# Altium schematic sheet SBH_Charger_USB_PD.SchDoc: Sample Sheet Title
size B; Date: MM/DD/YYYY; Author: Sample Author; Organization: ORGANIZATION; Address1: ADDRESS 1; Address2: ADDRESS 2; Address3: ADDRESS 3; Address4: ADDRESS 4; Revision: -; SheetNumber: 3; SheetTotal: 5; ENG_APP_DATE: --/--/--; DSN_APP_DATE: --/--/--; CHK_APP_DATE: --/--/--
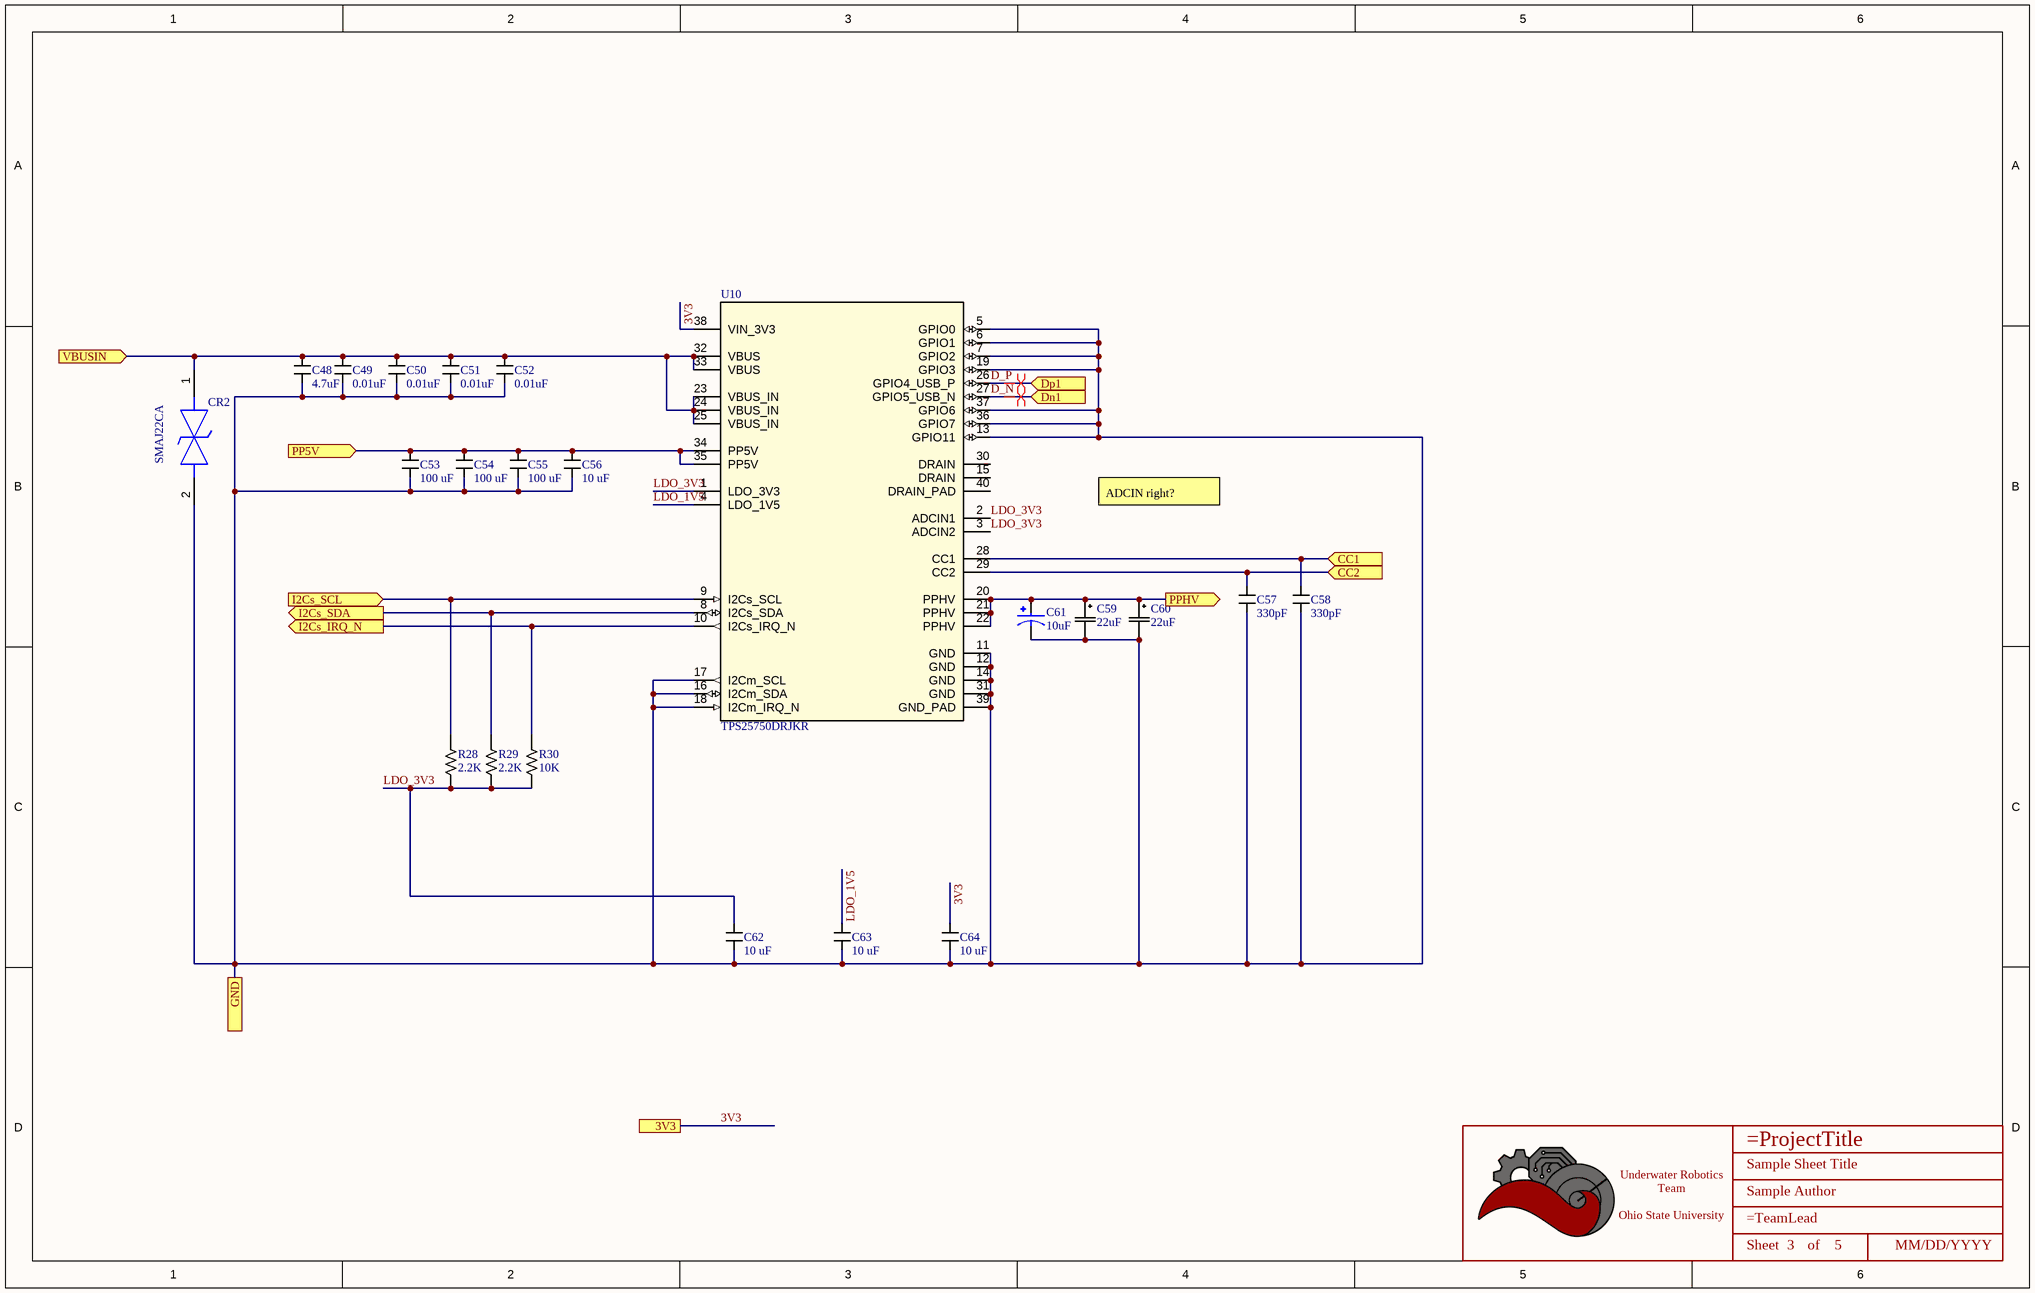
[diagram p0: SBH_Charger_USB_PD.SchDoc]

## Parts
*  Title_Block  [LOGO]  (value not drawn)  (graphical)
C48  value 4.7uF  [CAPACITOR_0603]  (hidden comment: 4.7uF Ceramic 6.3V)
C49  value 0.01uF  [CAPACITOR_0603]  (hidden comment: 10nF Ceramic 6.3V)
C50  value 0.01uF  [CAPACITOR_0603]  (hidden comment: 10nF Ceramic 6.3V)
C51  value 0.01uF  [CAPACITOR_0603]  (hidden comment: 10nF Ceramic 6.3V)
C52  value 0.01uF  [CAPACITOR_0603]  (hidden comment: 10nF Ceramic 6.3V)
C53  Value (uF): 100 uF  [CAPACITOR_0603]  (hidden comment: 100uF Ceramic 6.3V)
C54  Value (uF): 100 uF  [CAPACITOR_0603]  (hidden comment: 100uF Ceramic 6.3V)
C55  Value (uF): 100 uF  [CAPACITOR_0603]  (hidden comment: 100uF Ceramic 6.3V)
C56  Value (uF): 10 uF  [CAPACITOR_0603]  (hidden comment: 10uF Ceramic 6.3V)
C57  value 330pF  [CAPACITOR_0603]  (hidden comment: 330pF Ceramic 16V)
C58  value 330pF  [CAPACITOR_0603]  (hidden comment: 330pF Ceramic 16V)
C59  value 22uF  [PCAP_8x5.4-ELECT_NCA]  (hidden comment: 22uF electrolytic 35 V)
C60  value 22uF  [PCAP_8x5.4-ELECT_NCA]  (hidden comment: 22uF electrolytic 35 V)
C61  value 10uF  [CAP_EEHZC1J100P]  (hidden comment: 10uF electrolytic 63V)
C62  Value (uF): 10 uF  [CAPACITOR_0603]  (hidden comment: 10uF Ceramic 6.3V)
C63  Value (uF): 10 uF  [CAPACITOR_0603]  (hidden comment: 10uF Ceramic 6.3V)
C64  Value (uF): 10 uF  [CAPACITOR_0603]  (hidden comment: 10uF Ceramic 6.3V)
CR2  SMAJ22CA  [FP-SMAJ-CA-MFG]
R28  Value  (Ohms): 2.2K  [RESISTOR_0402]  (hidden comment: 2.2k Ohm 1% 1/16W)
R29  Value  (Ohms): 2.2K  [RESISTOR_0402]  (hidden comment: 2.2k Ohm 1% 1/16W)
R30  Value  (Ohms): 10K  [RESISTOR_0402]  (hidden comment: 10k Ohm 1% 1/16W)
U10  TPS25750DRJKR  [38-WQFN (4x6)]

## Ports
3V3, CC1 (in), CC2 (in), Dn1 (in), Dp1 (in), GND, I2Cs_IRQ_N (out), I2Cs_SCL (in), I2Cs_SDA (out), PP5V (in), PPHV (out), VBUSIN (in)

## Nets
3V3: C64.1 U10.38(VIN_3V3) ; port 3V3
CC1: C58.1 U10.28(CC1) ; port CC1
CC2: C57.1 U10.29(CC2) ; port CC2
D_N: U10.27(GPIO5_USB_N) ; port Dn1
D_P: U10.26(GPIO4_USB_P) ; port Dp1
GND: C48.2 C49.2 C50.2 C51.2 C52.2 C53.2 C54.2 C55.2 C56.2 C57.2 C58.2 C59.2 C60.2 C61.2 C62.2 C63.2 C64.2 CR2.2 U10.5(GPIO0) U10.6(GPIO1) U10.7(GPIO2) U10.11(GND) U10.12(GND) U10.13(GPIO11) U10.14(GND) U10.16(I2Cm_SDA) U10.17(I2Cm_SCL) U10.18(I2Cm_IRQ_N) U10.19(GPIO3) U10.31(GND) U10.36(GPIO7) U10.37(GPIO6) U10.39(GND_PAD) ; port GND
I2Cs_IRQ_N: R30.1 U10.10(I2Cs_IRQ_N) ; port I2Cs_IRQ_N
I2Cs_SCL: R28.1 U10.9(I2Cs_SCL) ; port I2Cs_SCL
I2Cs_SDA: R29.1 U10.8(I2Cs_SDA) ; port I2Cs_SDA
LDO_1V5: C63.1 U10.4(LDO_1V5)
LDO_3V3: C62.1 R28.2 R29.2 R30.2 U10.1(LDO_3V3) U10.2(ADCIN1) U10.3(ADCIN2)
PP5V: C53.1 C54.1 C55.1 C56.1 U10.34(PP5V) U10.35(PP5V) ; port PP5V
PPHV: C59.1 C60.1 C61.1 U10.20(PPHV) U10.21(PPHV) U10.22(PPHV) ; port PPHV
VBUSIN: C48.1 C49.1 C50.1 C51.1 C52.1 CR2.1 U10.23(VBUS_IN) U10.24(VBUS_IN) U10.25(VBUS_IN) U10.32(VBUS) U10.33(VBUS) ; port VBUSIN

Not connected (* = marked no-connect by the designer): U10 15(DRAIN) 30(DRAIN) 40(DRAIN_PAD)

## Layout directives
differential pair: D_N, D_P

## Notes on the sheet
- ADCIN right?
- DWG. NO.
- REV.
- SHT.
- THIS DOCUMENT AND THE DATA DISCLOSED HEREIN OR HEREWITH IS THE PROPERTY OF ALTIUM LIMITED AND MAY BE FREELY DISTRIBUTED IN WHOLE. NO RIGHTS ARE RESERVED OR EXPRESS OR IMPLIED WARANTEE GIVEN.
- REVISION
- DESCRIPTION
- DATE
- APPROVED
- ENG:
- APPROVALS
- PROJECT
- DSN:
- CHK:
- REFERENCE DOCUMENTS
- PROJECT REVISION:
- TITLE
- DOCUMENT REVISION:
- DESIGN ITEM:
- BOM:
- FAB DWG:
- PCB DWG:
- ASSY DWG:
- SCALE:
- SIZE
- B
- CAGE CODE
- FILE NAME
- DWG NO.
- SHEET
- OF
- REV
- (in symbol Title_Block) Underwater Robotics Team / Ohio State University; Sheet; of

## Library data of the parts
* = Title_Block: UWRT Schematic Title Block Template / Created June 2021, Dylan Trainor
C48 = CAPACITOR_4.7uF_0603: Cap 4.7uF 6.3V +/-10% / Ceramic 0603; Made By: Robert Pafford; Tolerance: +/- 10%; Voltage: 6.3V; Supplier 1: Digi-Key; Supplier Part Number 1: 1276-2087-1-ND
C49-C52 = CAPACITOR_0.01uF_0603: Cap 10nF 6.3V +/-20% / Ceramic 0603; Tolerance: +/- 10%; Made By: Flip B; ComponentLink1Description: Datsheet; ComponentLink1URL: https://www.mouser.com/datasheet/2/212/KEM_C1002_X7R_SMD-1102033.pdf; Voltage: 6.3V; Supplier 1: Mouser; Supplier Part Number 1: 80-C0603C103K9R
C53-C55 = CAPACITOR_100uF_0603: Cap 100uF 6.3V +/-20% / Ceramic 0603; Made By: Dylan Trainor; ComponentLink1Description: Digikey; ComponentLink1URL: https://www.digikey.com/en/products/detail/samsung-electro-mechanics/CL10A106MQ8NNNC/3886777; Tolerance: +/- 20%; Voltage: 6.3V; Supplier 1: RSComponents; Supplier Part Number 1: 6911206
C56 C62-C64 = CAPACITOR_10uF_0603: Cap 10uF 6.3V +/-20% / Ceramic 0603; Made By: Flip B; ComponentLink1Description: Digikey; ComponentLink1URL: https://www.digikey.com/en/products/detail/samsung-electro-mechanics/CL10A106MQ8NNNC/3886777; Supplier 1: Digi-Key; Supplier Part Number 1: 1276-1119-1-ND; Tolerance: +/- 20%; Voltage: 6.3V
C57 C58 = CAPACITOR_0.00033uF_0603: Cap 330pF 16V +/-5% / Ceramic 0603; Made By: Flip B; ComponentLink1Description: Datsheet; ComponentLink1URL: https://www.we-online.de/katalog/datasheet/885012006026.pdf; Tolerance: +/- 5%; Voltage: 16V; Supplier 1: Digi-Key; Supplier Part Number 1: 732-7769-1-ND
C59 C60 = CAP ALUM 22UF 20% 35V SMD: 22 µF 35 V Aluminum Electrolytic Capacitors Radial, Can - SMD 1000 Hrs; Made by: Robert Pafford; Voltage: 35V; Supplier 1: Digi-Key; Supplier Part Number 1: PCE3952DKR-ND
C61 = CAP ALUM 10UF 20% 63V SMD: 10 µF 63 V Aluminum - Polymer Capacitors Radial, Can SMD 120mOhm; Made by: Robert Pafford; Tolerance: +/- 20%; Max Voltage: 63V; Supplier 1: Digi-Key; Supplier Part Number 1: P15466CT-ND
CR2 = CMP-08607-000106-1: TVS DIODE 22V 35.5V DO214AC; Power Line Protection: No; Max Breakdown Voltage: 26.9V; Number of Elements: 1; Min Breakdown Voltage: 24.4V; Polarity: Bidirectional; Peak Pulse Power: 400W; Max Surge Current: 11.3A; Leakage Current: 1uA; Max Power Dissipation: 3.3W; Test Current: 1mA; Min Operating Temperature: -65°C; Width: 2.79mm; Length: 5.28mm; Operating Supply Voltage: 22V; Number of Bidirectional Channels: 1; Reverse Standoff Voltage: 22V; Direction: Bidirectional; Mount: Surface Mount; Number of Channels: 1; Power Dissipation: 400W; Peak Pulse Current: 11.3A; Height: 2.29mm; Termination: SMD/SMT; Breakdown Voltage: 24.4V; Voltage Rating (DC): 22V; Lead Free: Lead Free; Clamping Voltage: 35.5V; Package Quantity: 5000; Packaging: Tape and Reel; Number of Pins: 2; Max Operating Temperature: 150°C; Composition: Zener; Reverse Breakdown Voltage: 24.4V
R28 R29 = RESISTOR_2.2K_0402_1: RES 2.2K OHM 1% 1/16W 0402; Tolerance: +/- 1%; Made By: Megan McCabe; Wattage: 1/16W; Supplier 1: Future Electronics; Supplier Part Number 1: 9737263
R30 = RESISTOR_10K_0402: RES 10k OHM 1% 1/16W 0402; Tolerance: +/- 1%; Made By: Robert Pafford; Wattage: 1/16W; Supplier: Digikey; Digikey Part Numer: CR0603-JW-104ELFTR-ND; Supplier 1: Digi-Key; Supplier Part Number 1: YAG3436CT-ND
U10 = TPS25750DRJKR: USB, Type-C Controller PMIC 38-WQFN (4x6); Mfr_Name: Texas Instruments; Made By: Andrew Lin; Type: DEV; RefDes: RefDes; Copyright: Copyright (C) 2023 Ultra Librarian. All rights reserved.; Manufacturer_Part_Number: TPS25750DRJKR